# EAGLE design bareduino-V1R3 (EAGLE 6.2)
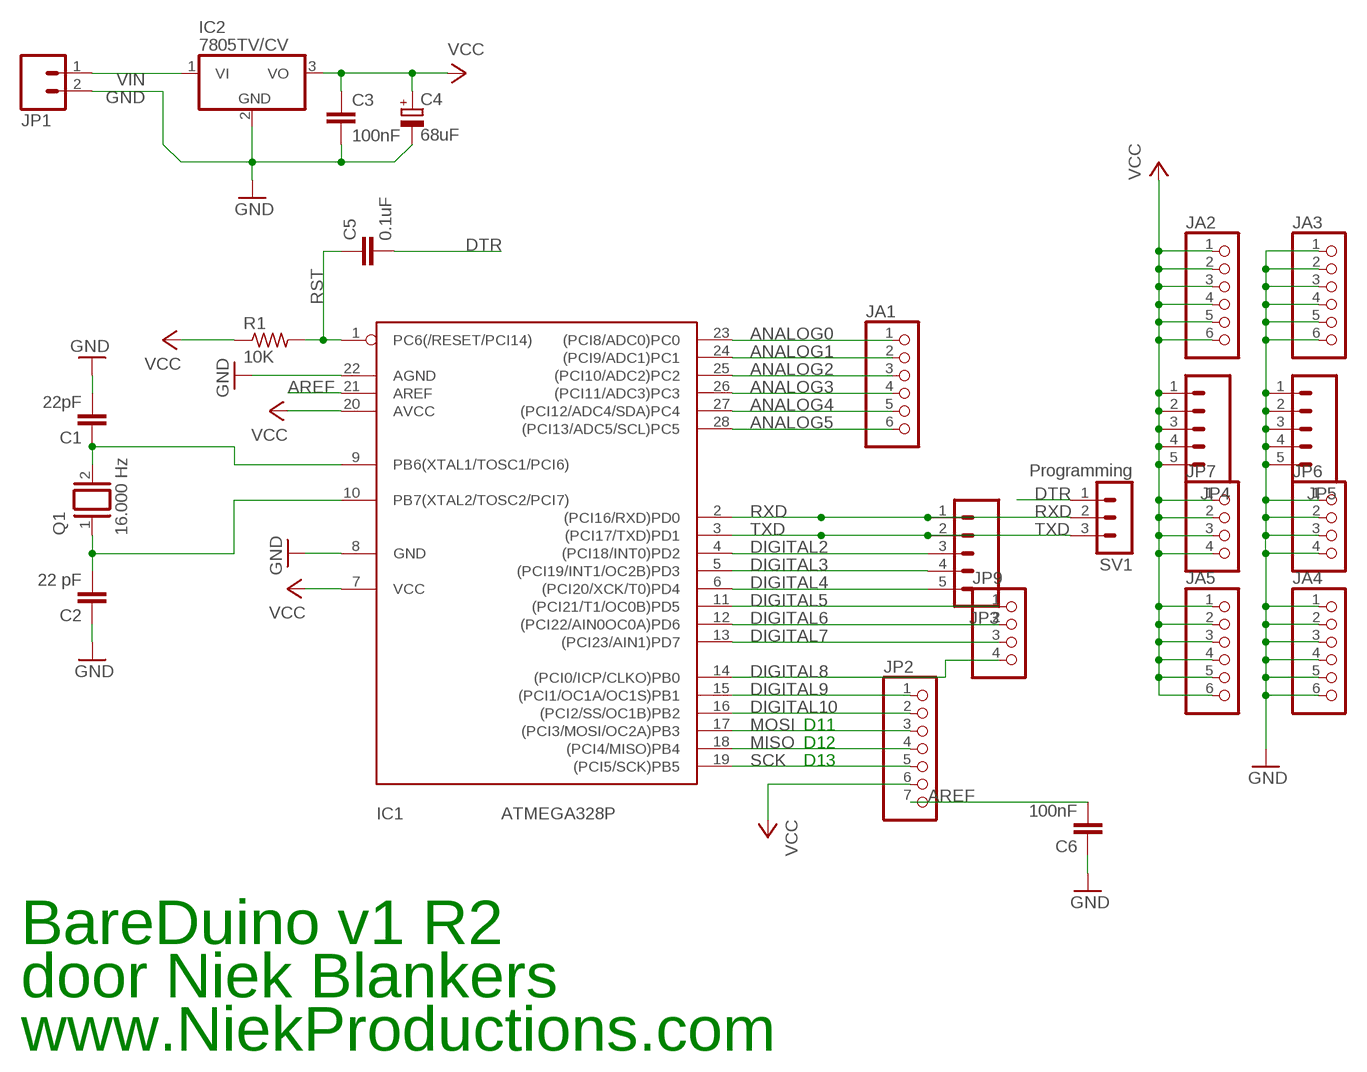
[diagram p0: schematic, sheet 1]

## Parts
C1  22pF  C-EU025-024X044  [C025-024X044]
C2  22 pF  C-EU025-024X044  [C025-024X044]
C3  100nF  C-EU025-025X050  [C025-025X050]
C4  68uF  CPOL-EUE2,5-6E  [E2,5-6E]
C5  0.1uF  C-EU025-024X044  [C025-024X044]
C6  100nF  C-EU025-024X044  [C025-024X044]
IC1  ATMEGA328P  ATMEGA168PROUND  [DIL28/3]
IC2  7805TV/CV  7805TV  [TO220V]
JA1  PINHD-1X6CB  [1X06-CLEANBIG]
JA2  PINHD-1X6CB  [1X06-CLEANBIG]
JA3  PINHD-1X6CB  [1X06-CLEANBIG]
JA4  PINHD-1X6CB  [1X06-CLEANBIG]
JA5  PINHD-1X6CB  [1X06-CLEANBIG]
JP1  M025MM  [SCREWTERMINAL-5MM-2]
JP2  PINHD-1X07_2.54-S  [1X07-S]
JP3  M05PTH  [1X05]
JP4  M05PTH  [1X05]
JP5  M05PTH  [1X05]
JP6  PINHD-1X04_2.54-S  [1X04-S]
JP7  PINHD-1X04_2.54-S  [1X04-S]
JP9  PINHD-1X04_2.54-S  [1X04-S]
Q1  16.000 Hz  XTAL/S  [QS]
R1  10K  R-US_0207/5V  [0207/5V]
SV1  Programming  MA03-1  [MA03-1]

## Nets
ANALOG0: IC1.23((PCI8/ADC0)PC0) JA1.1
ANALOG1: IC1.24((PCI9/ADC1)PC1) JA1.2
ANALOG2: IC1.25((PCI10/ADC2)PC2) JA1.3
ANALOG3: IC1.26((PCI11/ADC3)PC3) JA1.4
ANALOG4: IC1.27((PCI12/ADC4/SDA)PC4) JA1.5
ANALOG5: IC1.28((PCI13/ADC5/SCL)PC5) JA1.6
AREF: C6.2 IC1.21(AREF) JP2.7
DIGITAL2: IC1.4((PCI18/INT0)PD2) JP3.3
DIGITAL3: IC1.5((PCI19/INT1/OC2B)PD3) JP3.4
DIGITAL4: IC1.6((PCI20/XCK/T0)PD4) JP3.5
DIGITAL5: IC1.11((PCI21/T1/OC0B)PD5) JP9.1
DIGITAL6: IC1.12((PCI22/AIN0OC0A)PD6) JP9.2
DIGITAL7: IC1.13((PCI23/AIN1)PD7) JP9.3
DIGITAL8: IC1.14((PCI0/ICP/CLKO)PB0) JP9.4
DIGITAL9: IC1.15((PCI1/OC1A/OC1S)PB1) JP2.1
DIGITAL10: IC1.16((PCI2/SS/OC1B)PB2) JP2.2
DTR: C5.2 SV1.1
GND: C1.2 C2.1 C3.2 C4.- C6.1 IC1.8(GND) IC1.22(AGND) IC2.2(GND) JA3.1 JA3.2 JA3.3 JA3.4 JA3.5 JA3.6 JA4.1 JA4.2 JA4.3 JA4.4 JA4.5 JA4.6 JP1.2 JP5.1 JP5.2 JP5.3 JP5.4 JP5.5 JP6.1 JP6.2 JP6.3 JP6.4
MISO: IC1.18((PCI4/MISO)PB4) JP2.4
MOSI: IC1.17((PCI3/MOSI/OC2A)PB3) JP2.3
N$2: C2.2 IC1.10(PB7(XTAL2/TOSC2/PCI7)) Q1.1
N$5: C1.1 IC1.9(PB6(XTAL1/TOSC1/PCI6)) Q1.2
RST: C5.1 IC1.1(PC6(/RESET/PCI14)) R1.2
RXD: IC1.2((PCI16/RXD)PD0) JP3.1 SV1.2
SCK: IC1.19((PCI5/SCK)PB5) JP2.5
TXD: IC1.3((PCI17/TXD)PD1) JP3.2 SV1.3
VCC: C3.1 C4.+ IC1.7(VCC) IC1.20(AVCC) IC2.3(VO) JA2.1 JA2.2 JA2.3 JA2.4 JA2.5 JA2.6 JA5.1 JA5.2 JA5.3 JA5.4 JA5.5 JA5.6 JP2.6 JP4.1 JP4.2 JP4.3 JP4.4 JP4.5 JP7.1 JP7.2 JP7.3 JP7.4 R1.1
VIN: IC2.1(VI) JP1.1

## Notes on the sheet
- D11
- D12
- D13
- BareDuino v1 R2
- door Niek Blankers
- www.NiekProductions.com

## Library data of the parts
C1-C3 C5 C6 = resistor:C-EU: CAPACITOR, European symbol
C4 = resistor:CPOL-EU: POLARIZED CAPACITOR, European symbol
IC1 = avr:ATMEGA168*P: MICROCONTROLLER 16 kBytes FLASH 1 kBytes SRAM 512 Bytes EEPROM USART 8-channel 10 bit ADC
IC2 = linear:78*: Positive VOLTAGE REGULATOR Source: http://cache.national.com/ds/LM/LM78L05.pdf http://www.fairchildsemi.com/ds/LM/LM7805.pdf
JA1-JA5 = carduino:PINHD-1X6: PIN HEADER
JP1 = SparkFun:M02: Header 2 Standard 2-pin 0.1" header. Use with straight break away headers (SKU : PRT-00116), right angle break away headers (PRT-00553), swiss pins (PRT-00743), machine pins (PRT-00117), and female headers (PRT-00115). Molex polarized connector foot print use with SKU : PRT-08233 with associated crimp pins and housings.
JP2 = pinhead-2:PINHD-1X07: PIN HEADER
JP3-JP5 = SparkFun:M05: Header 5 Standard 5-pin 0.1" header. Use with straight break away headers (SKU : PRT-00116), right angle break away headers (PRT-00553), swiss pins (PRT-00743), machine pins (PRT-00117), and female headers (PRT-00115). Molex polarized connector foot print use with SKU : PRT-08230 with associated crimp pins and housings.
JP6 JP7 JP9 = pinhead-2:PINHD-1X04: PIN HEADER
Q1 = special:XTAL/S: CRYSTAL
R1 = rcl-ez:R-US_: RESISTOR, American symbol
SV1 = con-lstb:MA03-1: PIN HEADER

## Board
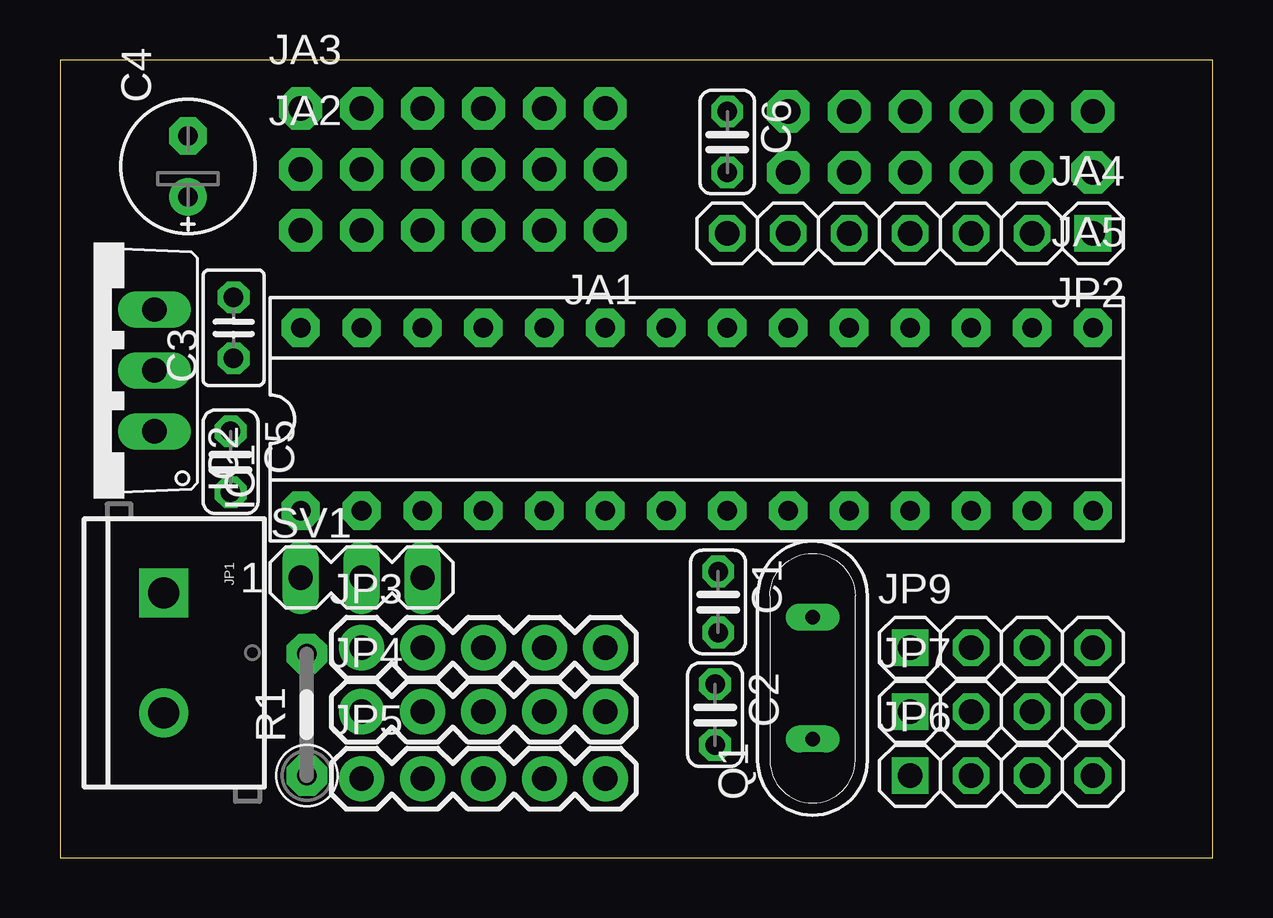
[diagram p1: board, top side]
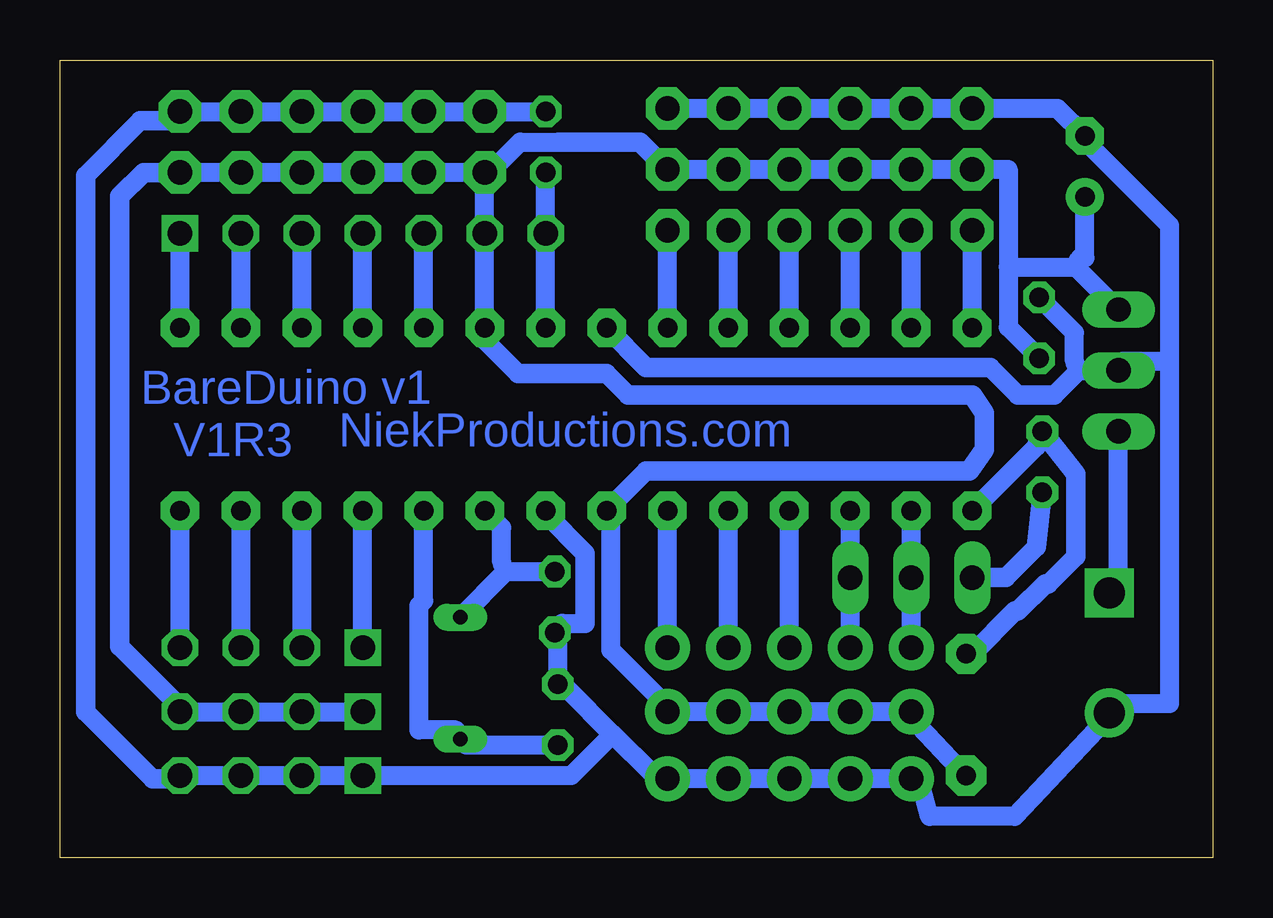
[diagram p2: board, bottom side, seen from below]

Size 48.06 x 33.26 mm. Coordinates in mm from the lower left corner, seen from the top.
Outline: 0,0 48.06,0 48.06,33.26 0,33.26 0,0
Copper layers (1*16): Top 0.035mm / dielectric 1.5mm / Bottom 0.035mm
Design rules: minimum track width 0.8mm, minimum drill 0.8mm, track to track 8mil, track to pad 8mil, pad to pad 8mil, via to via 8mil, smd to smd 8mil, copper to edge 40mil, drill to drill 8mil, minimum pad ring 10mil, minimum via ring 8mil, stop-mask expansion 4mil, vias tented up to drill 0mil, thermal gap 10mil

### Footprints (pad centres in the part's own frame; a part is rotated, then mirrored left to right if it is on the bottom)
C025-024X044 = drill 0.813 octagon: 1 -1.27,0; 2 1.27,0
C025-025X050 = drill 0.813 octagon: 1 -1.27,0; 2 1.27,0
E2,5-6E = drill 0.813 pad 1.575: + -1.27,0 | drill 0.813 pad 1.575 octagon: - 1.27,0
DIL28/3 = drill 0.813 pad 1.6 octagon: 1 -16.51,-3.81; 2 -13.97,-3.81; 3 -11.43,-3.81; 4 -8.89,-3.81; 5 -6.35,-3.81; 6 -3.81,-3.81; 7 -1.27,-3.81; 8 1.27,-3.81; 9 3.81,-3.81; 10 6.35,-3.81; 11 8.89,-3.81; 12 11.43,-3.81; 13 13.97,-3.81; 14 16.51,-3.81; 15 16.51,3.81; 16 13.97,3.81; 17 11.43,3.81; 18 8.89,3.81; 19 6.35,3.81; 20 3.81,3.81; 21 1.27,3.81; 22 -1.27,3.81; 23 -3.81,3.81; 24 -6.35,3.81; 25 -8.89,3.81; 26 -11.43,3.81; 27 -13.97,3.81; 28 -16.51,3.81
TO220V = drill 1.016 long: 1 -2.54,-2.54; 2 0,-2.54; 3 2.54,-2.54
1X06-CLEANBIG = drill 1.016 pad 1.778 octagon: 1 -6.35,0; 2 -3.81,0; 3 -1.27,0; 4 1.27,0; 5 3.81,0; 6 6.35,0
SCREWTERMINAL-5MM-2 = drill 1.3 pad 2.032 square: 1 0,0 | drill 1.3 pad 2.032: 2 5,0
1X07-S = drill 1.016 square: 1 -7.62,0 | drill 1.016 octagon: 2 -5.08,0; 3 -2.54,0; 4 0,0; 5 2.54,0; 6 5.08,0; 7 7.62,0
1X05 = drill 1.016 pad 1.88: 1 0,0; 2 2.54,0; 3 5.08,0; 4 7.62,0; 5 10.16,0
1X04-S = drill 1.016 square: 1 -3.81,0 | drill 1.016 octagon: 2 -1.27,0; 3 1.27,0; 4 3.81,0
QS = drill 0.61 long: 1 -2.54,0; 2 2.54,0
0207/5V = drill 0.813 pad 1.676 octagon: 1 -2.54,0; 2 2.54,0
MA03-1 = drill 1.016 long: 1 -2.54,0; 2 0,0; 3 2.54,0

### Placement (x,y rotation side)
C1  27.43,10.67 270 top
C2  27.3,5.97 270 top
C3  7.24,22.1 90 top
C4  5.33,28.83 90 top
C5  7.11,16.51 270 top
C6  27.81,29.85 270 top
IC1  26.54,18.29 0 top
IC2  1.4,20.32 90 top
JA1  16.38,26.16 180 top
JA2  16.38,28.7 0 top
JA3  16.38,31.24 0 top
JA4  36.7,31.12 180 top
JA5  36.7,28.58 180 top
JP1  4.32,11.05 270 top
JP2  35.43,26.04 180 top
JP3  12.57,8.76 0 top
JP4  12.57,6.1 0 top
JP5  12.57,3.3 0 top
JP6  39.24,3.43 0 top
JP7  39.24,6.1 0 top
JP9  39.24,8.76 0 top
Q1  31.37,7.49 90 top
R1  10.29,5.97 90 top
SV1  12.57,11.68 0 top

### Tracks (layer width: path | path; a pad name or v marks a point on that pad's centre or on a via)
ANALOG0
  Bottom 0.8: IC1.23 JA1.1
ANALOG1
  Bottom 0.8: IC1.24 JA1.2
ANALOG2
  Bottom 0.8: IC1.25 JA1.3
ANALOG3
  Bottom 0.8: IC1.26 JA1.4
ANALOG4
  Bottom 0.8: IC1.27 JA1.5
ANALOG5
  Bottom 0.8: IC1.28 JA1.6
AREF
  Bottom 0.8: C6.2 JP2.7 IC1.21
DIGITAL2
  Bottom 0.8: JP3.3 IC1.4
DIGITAL3
  Bottom 0.8: JP3.4 IC1.5
DIGITAL4
  Bottom 0.8: JP3.5 IC1.6
DIGITAL5
  Bottom 0.8: JP9.1 IC1.11
DIGITAL6
  Bottom 0.8: JP9.2 IC1.12
DIGITAL7
  Bottom 0.8: JP9.3 IC1.13
DIGITAL8
  Bottom 0.8: JP9.4 IC1.14
DIGITAL9
  Bottom 0.8: IC1.15 JP2.1
DIGITAL10
  Bottom 0.8: IC1.16 JP2.2
DTR
  Bottom 0.813: C5.2 7.37,12.95 8.64,11.68 SV1.1
GND
  Bottom 0.8: JA3.6 JA3.5 JA3.4 JA3.3 JA3.2 JA3.1 6.48,31.24 C4.- 5.16,29.72 1.8,26.37 1.8,20.7 | 1.8,20.7 3.76,20.7 IC2.2 | C6.1 JA4.6 JA4.5 JA4.4 JA4.3 JA4.2 JA4.1 43.23,30.73 | JP6.4 JP6.3 JP6.2 JP6.1 26.75,3.43 25.02,5.16 | 26.16,9.78 27.13,9.78 C1.2 27.3,9.4 C2.1 26.92,7.06 25.02,5.16 | 25.02,5.16 23.34,3.48 23.11,3.48 JP5.5 JP5.4 JP5.3 JP5.2 JP5.1 12.19,3.12 11.81,1.73 8.25,1.73 4.19,6.04 JP1.2 4.01,6.43 1.8,6.43 1.8,20.7 | C3.2 5.77,21.89 5.77,20.7 5.59,20.32
  Bottom 0.813: 43.23,30.73 44.7,30.73 46.99,28.45 46.99,6.1 44.2,3.3 43.18,3.3 JP6.4 | IC1.8 27.81,14.35 26.16,12.7 26.16,9.78 | IC1.22 23.62,20.45 9.27,20.45 8.13,19.3 6.6,19.3 5.59,20.32 IC2.2
MISO
  Bottom 0.8: IC1.18 JP2.4
MOSI
  Bottom 0.8: IC1.17 JP2.3
N$2
  Bottom 0.8: C2.2 31.12,4.7 Q1.1 31.55,5.33 33.1,5.33 33.1,10.52 32.89,10.72 IC1.10
N$5
  Bottom 0.8: Q1.2 29.46,11.94 | 29.46,11.94 C1.1 | IC1.9 29.64,13.77 29.64,12.32 29.46,11.94
RST
  Bottom 0.813: IC1.1 7.37,17.14 C5.1 5.71,16 5.71,12.57 6.86,11.43 6.99,11.43 8.13,10.29 8.25,10.29 10.03,8.51 R1.2
RXD
  Bottom 0.8: IC1.2 SV1.2 JP3.1
SCK
  Bottom 0.8: IC1.19 JP2.5
TXD
  Bottom 0.8: IC1.3 SV1.3 JP3.2
VCC
  Bottom 0.8: R1.1 12.57,5.84 JP4.1 JP4.2 JP4.3 JP4.4 JP4.5 22.91,6.48 25.1,8.66 25.1,14.1 IC1.7 | JA5.6 JP2.6 IC1.20 | JA5.6 JA5.5 JA5.4 JA5.3 JA5.2 JA5.1 | JP7.1 JP7.2 JP7.3 JP7.4 43.23,6.48 45.57,8.81 | C3.1 8.53,22.12 8.53,24.64 | 8.53,24.64 8.53,28.7 JA2.1 JA2.2 JA2.3 JA2.4 JA2.5 JA2.6 23.11,28.88 | 5.71,24.64 IC2.3 | 8.53,24.64 5.71,24.64 | C4.+ 5.33,25.02 5.54,25.02 5.71,24.64 | 27.28,29.85 28.88,29.85 29.97,28.75 JA5.6
  Bottom 0.813: 45.57,8.81 45.57,27.58 44.58,28.58 JA5.1 | 27.28,29.85 23.88,29.85 JA2.6 | IC1.20 30.35,21.59 28.96,20.19 25.27,20.19 24.38,19.3 10.03,19.3 9.52,18.54 9.52,17.02 10.16,16.13 23.62,16.13 IC1.7
VIN
  Bottom 0.8: IC2.1 3.94,11.05 JP1.1

### Text on the board
Bottom: BareDuino v1 | V1R3 | NiekProductions.com